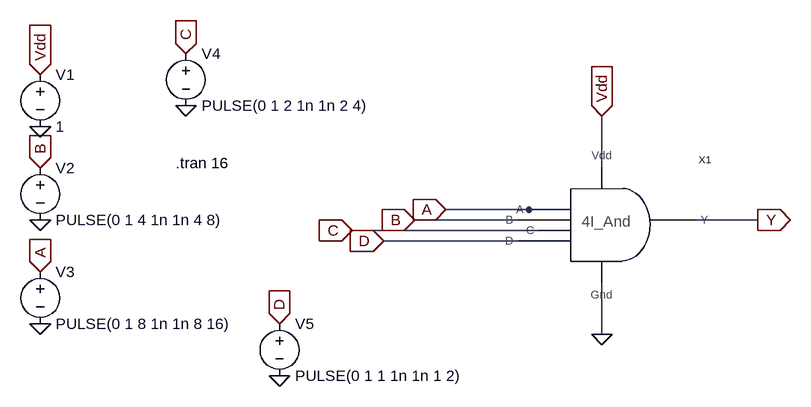
[diagram p0: schematic 4I_And_test.asc]
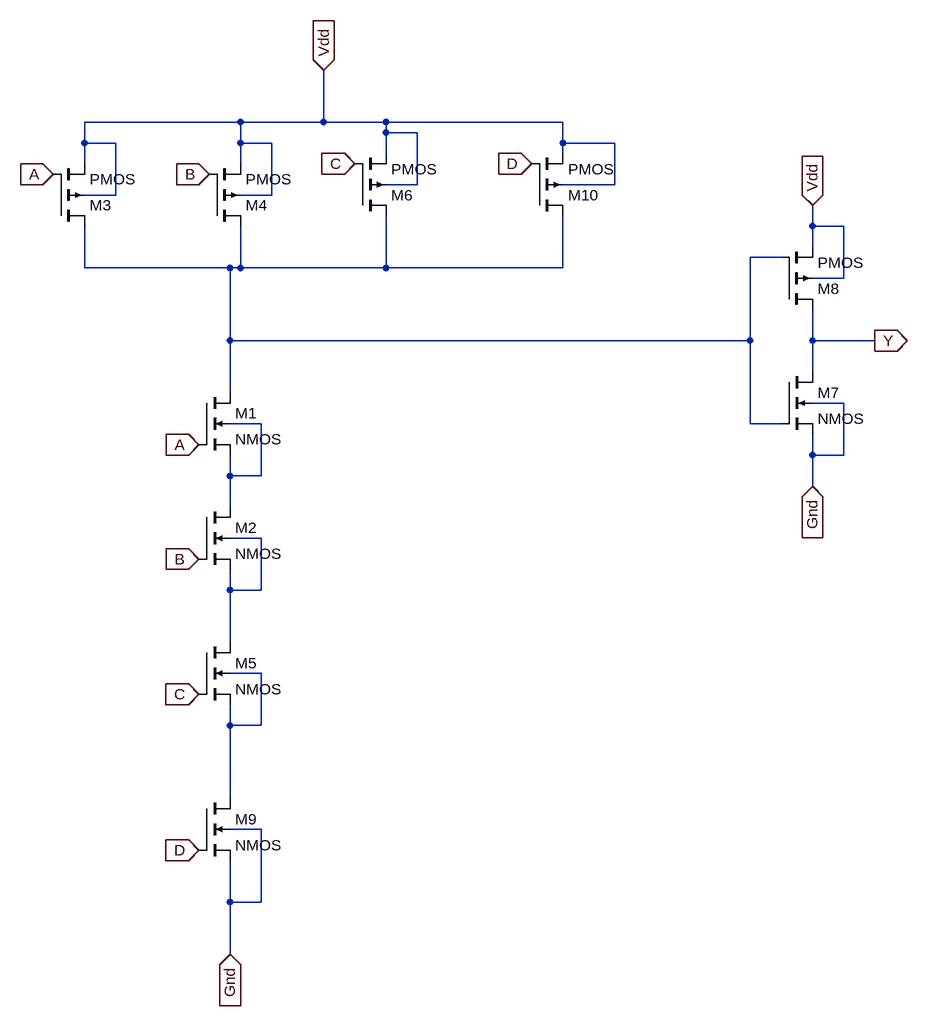
[diagram p1: sub-circuit 4iand.asc]
4I_And_test.asc, the LTspice schematic file:
Version 4
SHEET 1 888 680
WIRE 544 128 544 48
WIRE 432 192 304 192
WIRE 448 192 432 192
WIRE 416 208 256 208
WIRE 784 208 688 208
WIRE 448 224 160 224
WIRE 416 240 208 240
WIRE 544 384 544 304
FLAG -320 -16 Vdd
IOPIN -320 -16 In
FLAG -320 128 B
IOPIN -320 128 In
FLAG -320 288 A
IOPIN -320 288 In
FLAG -320 64 0
FLAG -320 208 0
FLAG -320 368 0
FLAG -96 -48 C
IOPIN -96 -48 In
FLAG -96 32 0
FLAG 48 368 D
IOPIN 48 368 In
FLAG 48 448 0
FLAG 544 384 0
FLAG 304 192 A
IOPIN 304 192 In
FLAG 256 208 B
IOPIN 256 208 In
FLAG 208 240 D
IOPIN 208 240 In
FLAG 160 224 C
IOPIN 160 224 In
FLAG 544 48 Vdd
IOPIN 544 48 In
FLAG 784 208 Y
IOPIN 784 208 Out
SYMBOL 4iAND 560 208 R0
SYMATTR InstName X1
SYMBOL voltage -320 -32 R0
SYMATTR InstName V1
SYMATTR Value 1
SYMBOL voltage -320 112 R0
WINDOW 123 0 0 Left 0
WINDOW 39 0 0 Left 0
SYMATTR InstName V2
SYMATTR Value PULSE(0 1 4 1n 1n 4 8)
SYMBOL voltage -320 272 R0
WINDOW 123 0 0 Left 0
WINDOW 39 0 0 Left 0
SYMATTR InstName V3
SYMATTR Value PULSE(0 1 8 1n 1n 8 16)
SYMBOL voltage -96 -64 R0
WINDOW 123 0 0 Left 0
WINDOW 39 0 0 Left 0
SYMATTR InstName V4
SYMATTR Value PULSE(0 1 2 1n 1n 2 4)
SYMBOL voltage 48 352 R0
WINDOW 123 0 0 Left 0
WINDOW 39 0 0 Left 0
SYMATTR InstName V5
SYMATTR Value PULSE(0 1 1 1n 1n 1 2)
TEXT -112 120 Left 2 !.tran 16

4iand.asc, the sub-circuit schematic file:
Version 4
SHEET 1 1020 1336
WIRE -32 -192 -272 -192
WIRE 96 -192 96 -272
WIRE 96 -192 -32 -192
WIRE 192 -192 96 -192
WIRE 464 -192 192 -192
WIRE 192 -176 192 -192
WIRE 240 -176 192 -176
WIRE -272 -160 -272 -192
WIRE -224 -160 -272 -160
WIRE -32 -160 -32 -192
WIRE 16 -160 -32 -160
WIRE 464 -160 464 -192
WIRE 544 -160 464 -160
WIRE 192 -144 192 -176
WIRE 464 -144 464 -160
WIRE -272 -128 -272 -160
WIRE -32 -128 -32 -160
WIRE 240 -96 240 -176
WIRE 240 -96 192 -96
WIRE 544 -96 544 -160
WIRE 544 -96 464 -96
WIRE -224 -80 -224 -160
WIRE -224 -80 -272 -80
WIRE 16 -80 16 -160
WIRE 16 -80 -32 -80
WIRE 848 -32 848 -64
WIRE 896 -32 848 -32
WIRE 848 0 848 -32
WIRE 800 16 752 16
WIRE -272 32 -272 -32
WIRE -48 32 -272 32
WIRE -32 32 -32 -32
WIRE -32 32 -48 32
WIRE 192 32 192 -48
WIRE 192 32 -32 32
WIRE 464 32 464 -48
WIRE 464 32 192 32
WIRE 896 48 896 -32
WIRE 896 48 848 48
WIRE -48 144 -48 32
WIRE 752 144 752 16
WIRE 752 144 -48 144
WIRE 848 144 848 96
WIRE 944 144 848 144
WIRE 848 192 848 144
WIRE -48 224 -48 144
WIRE 896 240 848 240
WIRE 0 272 -48 272
WIRE 752 272 752 144
WIRE 800 272 752 272
WIRE 848 320 848 288
WIRE 896 320 896 240
WIRE 896 320 848 320
WIRE -48 352 -48 320
WIRE 0 352 0 272
WIRE 0 352 -48 352
WIRE 848 368 848 320
WIRE -48 400 -48 352
WIRE 0 448 -48 448
WIRE -48 528 -48 496
WIRE 0 528 0 448
WIRE 0 528 -48 528
WIRE -48 608 -48 528
WIRE 0 656 -48 656
WIRE -48 736 -48 704
WIRE 0 736 0 656
WIRE 0 736 -48 736
WIRE -48 848 -48 736
WIRE 0 896 -48 896
WIRE -48 1008 -48 944
WIRE 0 1008 0 896
WIRE 0 1008 -48 1008
WIRE -48 1088 -48 1008
FLAG -96 480 B
IOPIN -96 480 In
FLAG -96 304 A
IOPIN -96 304 In
FLAG -320 -112 A
IOPIN -320 -112 In
FLAG -80 -112 B
IOPIN -80 -112 In
FLAG -96 688 C
IOPIN -96 688 In
FLAG 144 -128 C
IOPIN 144 -128 In
FLAG -48 1088 Gnd
IOPIN -48 1088 In
FLAG 848 -64 Vdd
IOPIN 848 -64 In
FLAG 848 368 Gnd
IOPIN 848 368 In
FLAG 944 144 Y
IOPIN 944 144 Out
FLAG -96 928 D
IOPIN -96 928 In
FLAG 416 -128 D
IOPIN 416 -128 In
FLAG 96 -272 Vdd
IOPIN 96 -272 In
SYMBOL nmos4 -96 224 R0
SYMATTR InstName M1
SYMBOL nmos4 -96 400 R0
SYMATTR InstName M2
SYMBOL pmos4 -320 -32 M180
SYMATTR InstName M3
SYMBOL pmos4 -80 -32 M180
SYMATTR InstName M4
SYMBOL nmos4 -96 608 R0
SYMATTR InstName M5
SYMBOL pmos4 144 -48 M180
SYMATTR InstName M6
SYMBOL nmos4 800 192 R0
SYMATTR InstName M7
SYMBOL pmos4 800 96 M180
SYMATTR InstName M8
SYMBOL nmos4 -96 848 R0
SYMATTR InstName M9
SYMBOL pmos4 416 -48 M180
SYMATTR InstName M10

The netlist it stands for:
* 4I_And_test.asc
XX1 A B C D Vdd 0 Y 4iand
V1 Vdd 0 1
V2 B 0 PULSE(0 1 4 1n 1n 4 8)
V3 A 0 PULSE(0 1 8 1n 1n 8 16)
V4 C 0 PULSE(0 1 2 1n 1n 2 4)
V5 D 0 PULSE(0 1 1 1n 1n 1 2)

* block symbol definitions
.subckt 4iand A B C D Vdd Gnd Y
M1 N001 A N002 N002 NMOS
M2 N002 B N003 N003 NMOS
M3 N001 A Vdd Vdd PMOS
M4 N001 B Vdd Vdd PMOS
M5 N003 C N004 N004 NMOS
M6 N001 C Vdd Vdd PMOS
M7 Y N001 Gnd Gnd NMOS
M8 Y N001 Vdd Vdd PMOS
M9 N004 D Gnd Gnd NMOS
M10 N001 D Vdd Vdd PMOS
.ends 4iand

.model NMOS NMOS
.model PMOS PMOS
.lib standard.mos
.tran 16
.backanno
.end

* Results of the author's LTspice run, read from the files saved beside the schematic
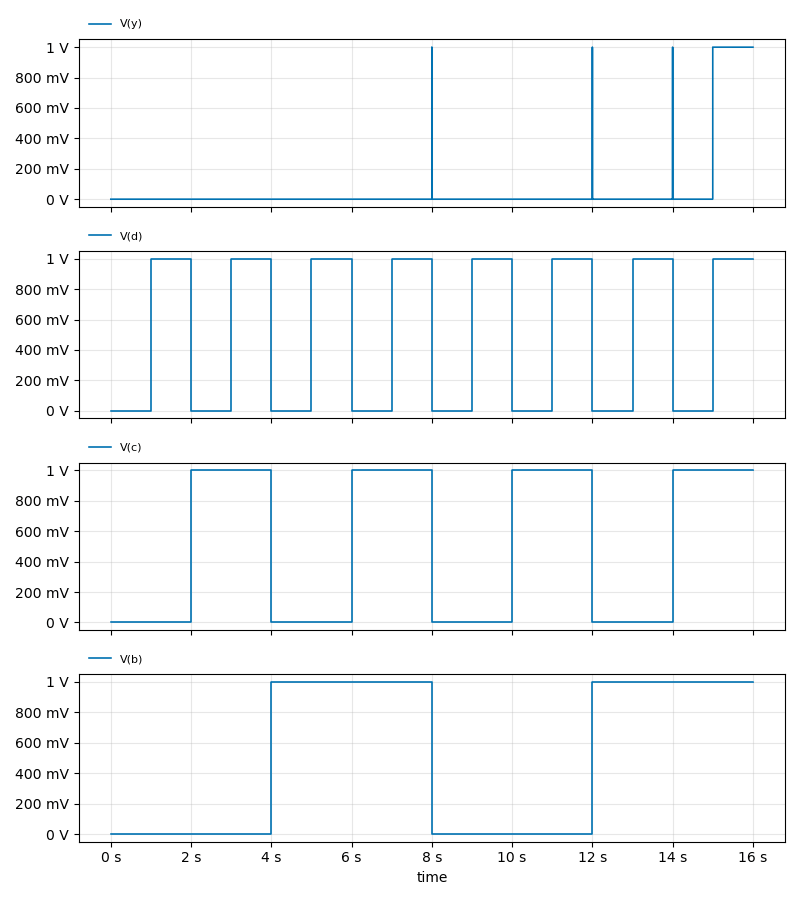
[diagram p2: Transient Analysis of 4I_And_test.asc, plotted from the saved traces]
* Transient Analysis, 1 run:
*   V(y): min 100.5 nV, max 1.001 V, average 62.5 mV, rms 250 mV, last 1 V
*   V(d): min 0 V, max 1 V, average 500 mV, rms 707.1 mV, last 1 V
*   V(c): min 0 V, max 1 V, average 500 mV, rms 707.1 mV, last 1 V
*   V(b): min 0 V, max 1 V, average 500 mV, rms 707.1 mV, last 1 V